# EAGLE design HandschuhGyro (EAGLE 6.5.0)
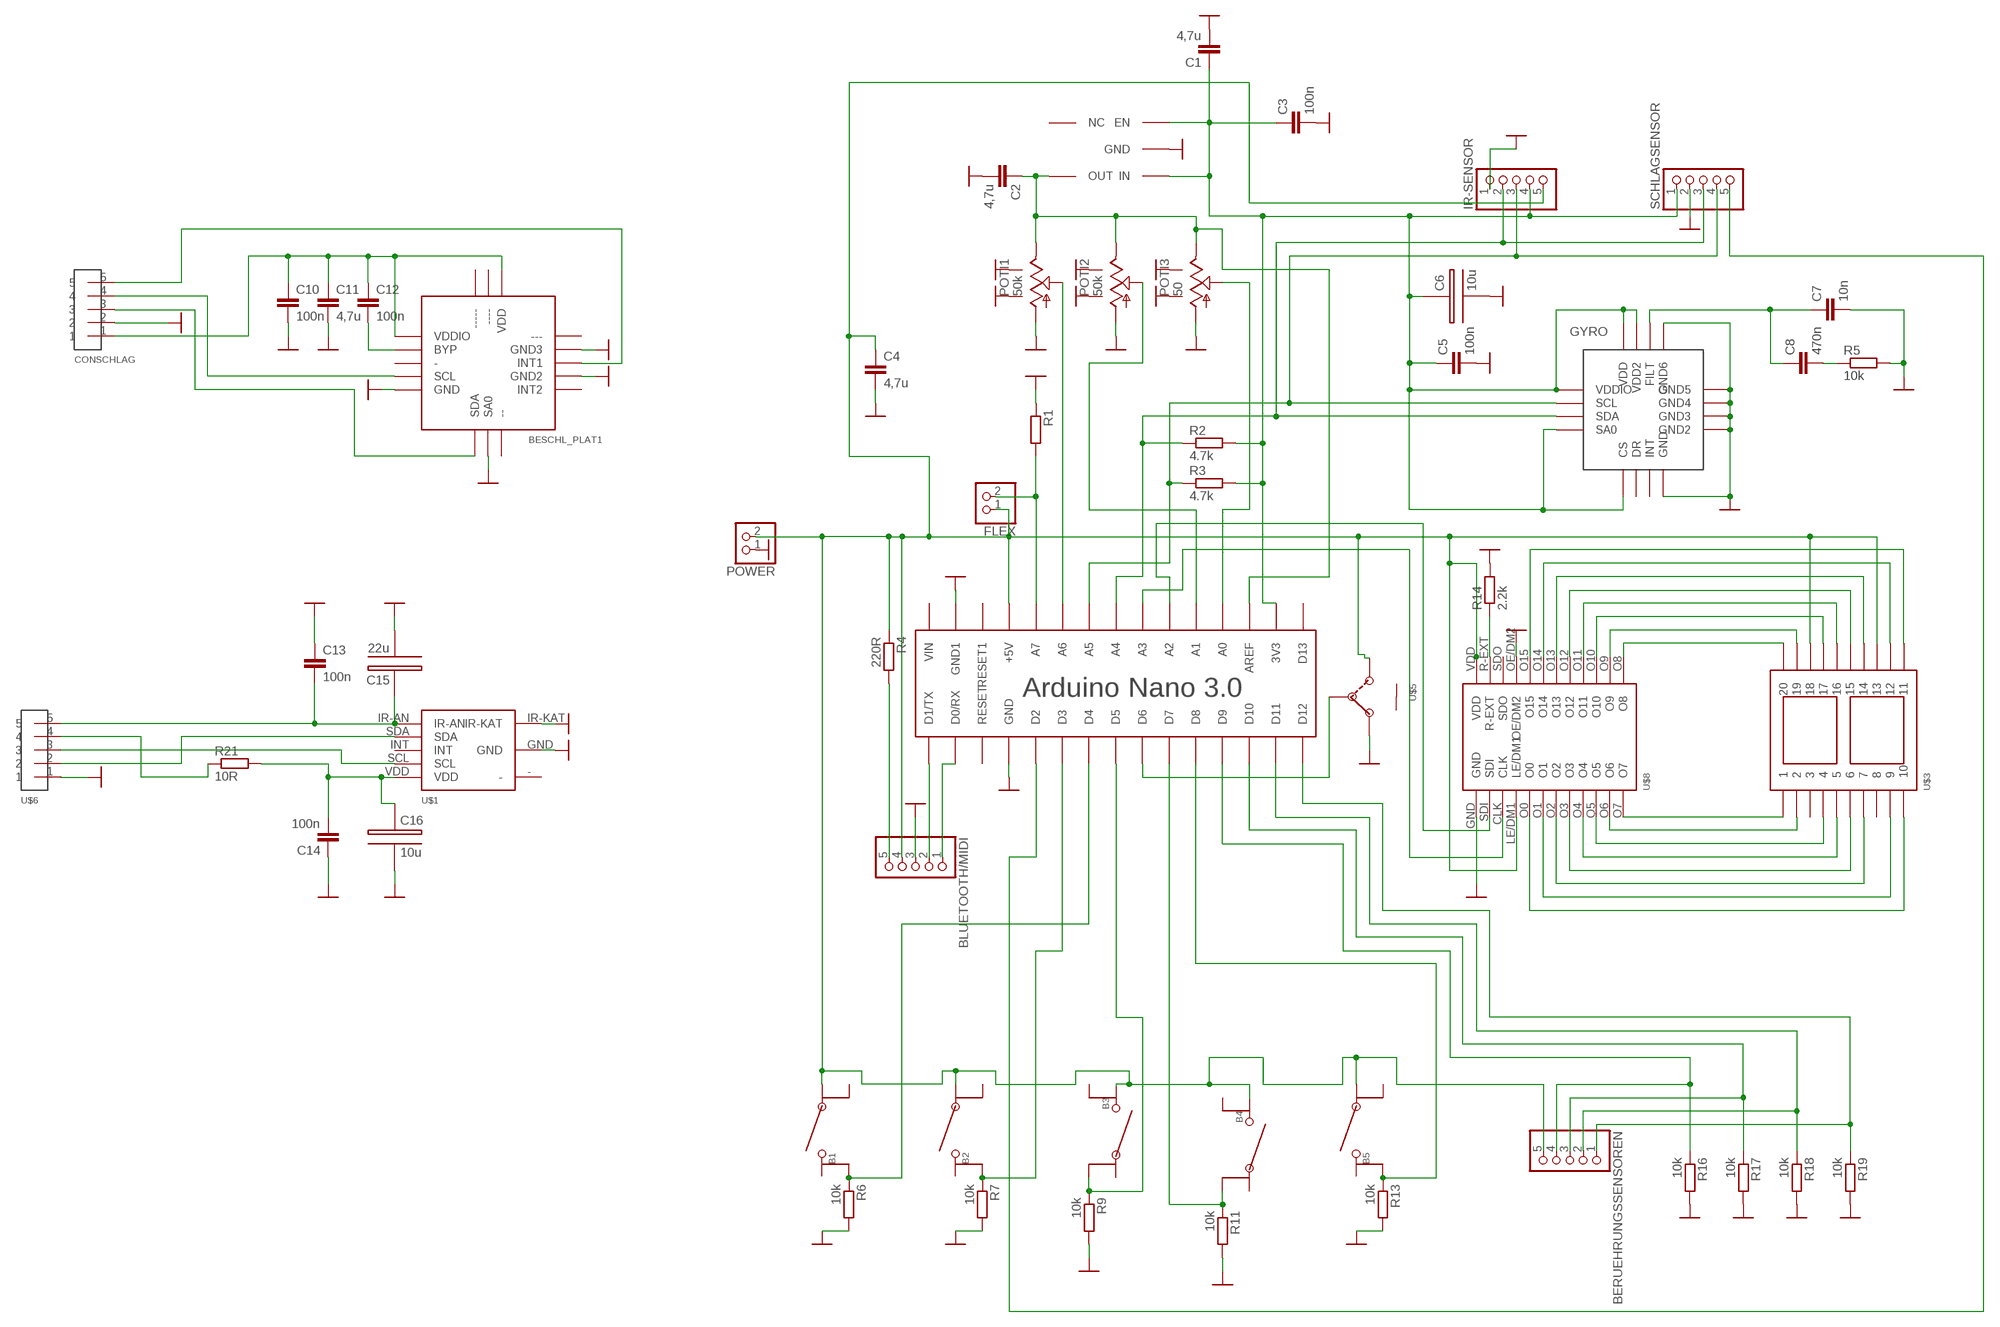
[diagram p0: schematic, sheet 1]

## Parts
B1  BUTTON  [BUTTON]
B2  BUTTON  [BUTTON]
B3  BUTTON  [BUTTON]
B4  BUTTON  [BUTTON]
B5  BUTTON  [BUTTON]
BERUEHRUNGSSENSOREN  PINHD-1X5  [1X05]
BESCHL_PLAT1  BESCHLEUNIGSUNGSSENSOR  [BESCHLEUNIGUNGSSENSOR]
BLUETOOTH/MIDI  PINHD-1X5  [1X05]
C1  4,7u  C-EUC0805  [C0805]
C2  4,7u  C-EUC0805  [C0805]
C3  100n  C-EUC0805  [C0805]
C4  4,7u  C-EUC0805  [C0805]
C5  100n  C-EUC0805  [C0805]
C6  10u  22U-KONDENSATOR  [22U-KONDENSATOR]
C7  10n  C-EUC0805  [C0805]
C8  470n  C-EUC0805  [C0805]
C10  100n  C-EUC0805  [C0805]
C11  4,7u  C-EUC0805  [C0805]
C12  100n  C-EUC0805  [C0805]
C13  100n  C-EUC0805  [C0805]
C14  100n  C-EUC0805  [C0805]
C15  22u  22U-KONDENSATOR  [22U-KONDENSATOR]
C16  10u  22U-KONDENSATOR  [22U-KONDENSATOR]
CONSCHLAG  BREAKBOARDCON2  [BREAKBOARDCON]
FLEX  PINHD-1X2  [1X02]
GYRO  GYRO  [GYRO]
IR-SENSOR  PINHD-1X5  [1X05]
POTI1  50k  POTI  [POTI]
POTI2  50k  POTI  [POTI]
POTI3  50  POTI  [POTI]
POWER  PINHD-1X2  [1X02]
R1  R-EU_M0805  [M0805]
R2  4.7k  R-EU_M0805  [M0805]
R3  4.7k  R-EU_M0805  [M0805]
R4  220R  R-EU_M0805  [M0805]
R5  10k  R-EU_M0805  [M0805]
R6  10k  R-EU_M0805  [M0805]
R7  10k  R-EU_M0805  [M0805]
R9  10k  R-EU_M0805  [M0805]
R11  10k  R-EU_M0805  [M0805]
R13  10k  R-EU_M0805  [M0805]
R14  2.2k  R-EU_M0805  [M0805]
R16  10k  R-EU_M0805  [M0805]
R17  10k  R-EU_M0805  [M0805]
R18  10k  R-EU_M0805  [M0805]
R19  10k  R-EU_M0805  [M0805]
R21  10R  R-EU_M0805  [M0805]
SCHLAGSENSOR  PINHD-1X5  [1X05]
U$1  IR-SENSOR  [IR-SENSOR]
U$2  ARDUINONANO  [PDIP-32]
U$3  7-SEGMENT  [7-SEGMENT]
U$4  1,1V-SPANNUNGSREGLER  [1,1V-SPANNUNGSREGLER]
U$5  SCHALTER  [SCHALTER]
U$6  BREAKBOARDCON2  [BREAKBOARDCON]
U$8  7-SEGMENT-TREIBER  [7-SEGMENT-TREIBER]

## Nets
3,3V: C1.1 C3.1 C5.1 C6.+ GYRO.CS GYRO.SA0 GYRO.VDD GYRO.VDD2 GYRO.VDDIO IR-SENSOR.4 R2.2 R3.2 SCHLAGSENSOR.1 U$2.3V3 U$4.EN U$4.IN
3,3V1: BESCHL_PLAT1.VDD BESCHL_PLAT1.VDDIO C10.1 C11.1 C12.1 CONSCHLAG.1
5V: B1.3 B2.3 B3.1 B4.1 B5.3 BERUEHRUNGSSENSOREN.5 BLUETOOTH/MIDI.4 C4.1 FLEX.1 IR-SENSOR.5 POWER.2 R4.1 U$2.+5V U$3.13 U$3.18 U$5.3 U$8.LE/DM1 U$8.VDD
GND: BESCHL_PLAT1.GND BESCHL_PLAT1.GND2 BESCHL_PLAT1.GND3 BESCHL_PLAT1.SA0 BLUETOOTH/MIDI.3 C1.2 C2.2 C3.2 C4.2 C5.2 C6.- C7.2 C10.2 C11.2 C13.1 C14.1 C15.- C16.- CONSCHLAG.2 GYRO.GND GYRO.GND2 GYRO.GND3 GYRO.GND4 GYRO.GND5 GYRO.GND6 IR-SENSOR.1 POTI1.FIX1(FUSS1) POTI1.FIX2(FUSS2) POTI1.GND POTI2.FIX1(FUSS1) POTI2.FIX2(FUSS2) POTI2.GND POTI3.FIX1(FUSS1) POTI3.FIX2(FUSS2) POTI3.GND POWER.1 R1.1 R5.2 R6.2 R7.2 R9.2 R11.2 R13.2 R14.2 R16.2 R17.2 R18.2 R19.2 SCHLAGSENSOR.2 U$1.GND U$1.IR-KAT U$2.GND U$2.GND1 U$4.GND U$5.1 U$6.1 U$8.GND U$8.OE/DM2
N$1: C2.1 POTI1.VCC POTI2.VCC POTI3.VCC U$2.AREF U$4.OUT
N$2: BESCHL_PLAT1.BYP C12.2
N$3: C7.1 C8.1 GYRO.FILT
N$4: FLEX.2 R1.2 U$2.A0(A7)
N$5: C8.2 R5.1
N$6: SCHLAGSENSOR.5 U$2.D2
N$7: POTI1.VALUE U$2.A1(A6)
N$8: POTI2.VALUE U$2.A6(A1)
N$9: U$1.SDA U$6.2
N$10: BESCHL_PLAT1.SCL CONSCHLAG.4
N$11: BLUETOOTH/MIDI.2 U$2.D1/TX
N$12: BLUETOOTH/MIDI.1 U$2.D0/RX
N$13: BLUETOOTH/MIDI.5 R4.2
N$14: BESCHL_PLAT1.SDA CONSCHLAG.3
N$15: B1.2 R6.1 U$2.D4
N$16: R21.1 U$6.4
N$17: B2.2 R7.1 U$2.D3
N$20: B4.4 R11.1 U$2.D7
N$21: B5.2 R13.1 U$2.D8
N$28: U$2.A5(A2) U$8.SDI
N$30: U$2.A4(A3) U$8.CLK
N$31: U$3.9 U$8.O1
N$32: U$3.1 U$8.O7
N$33: U$3.2 U$8.O6
N$34: U$3.4 U$8.O5
N$35: U$3.5 U$8.O4
N$36: U$3.6 U$8.O3
N$37: U$3.7 U$8.O2
N$38: U$3.10 U$8.O0
N$39: U$3.20 U$8.O8
N$40: U$3.19 U$8.O9
N$41: U$3.17 U$8.O10
N$42: U$3.16 U$8.O11
N$43: U$3.15 U$8.O12
N$44: U$3.14 U$8.O13
N$45: U$3.12 U$8.O14
N$46: U$3.11 U$8.O15
N$47: BERUEHRUNGSSENSOREN.4 R16.1 U$2.D9
N$48: R14.1 U$8.R-EXT
N$50: BESCHL_PLAT1.INT1 CONSCHLAG.5
N$51: BERUEHRUNGSSENSOREN.3 R17.1 U$2.D10
N$52: BERUEHRUNGSSENSOREN.2 R18.1 U$2.D11
N$53: BERUEHRUNGSSENSOREN.1 R19.1 U$2.D12
N$54: U$2.D6 U$5.2
N$55: GYRO.SCL IR-SENSOR.3 R3.1 SCHLAGSENSOR.4 U$2.A2(A5)
N$56: C13.2 C15.+ U$1.IR-AN U$6.5
N$57: C14.2 C16.+ R21.2 U$1.VDD
N$58: GYRO.SDA IR-SENSOR.2 R2.1 SCHLAGSENSOR.3 U$2.A3(A4)
N$61: U$1.SCL U$6.3
N$67: POTI3.VALUE U$2.A7(A0)
N$69: B3.4 R9.1 U$2.D5
Unconnected: B1.1 B1.4 B2.1 B2.4 B3.2 B3.3 B4.2 B4.3 B5.1 B5.4 BESCHL_PLAT1.- BESCHL_PLAT1.-- BESCHL_PLAT1.--- BESCHL_PLAT1.---- BESCHL_PLAT1.----- BESCHL_PLAT1.INT2 GYRO.DR GYRO.INT U$1.- U$1.INT U$2.D13 U$2.RESET U$2.RESET1 U$2.VIN U$3.3 U$3.8 U$4.NC U$5.4 U$5.5 U$8.SDO

## Notes on the sheet
- Arduino Nano 3.0

## Library data of the parts
B1-B5 = Handschuh:BUTTON
BERUEHRUNGSSENSOREN BLUETOOTH/MIDI IR-SENSOR SCHLAGSENSOR = pinhead:PINHD-1X5: PIN HEADER
BESCHL_PLAT1 = beschleunigungssensor:BESCHLEUNIGSUNGSSENSOR
C1-C5 C7 C8 C10-C14 = rcl:C-EU: CAPACITOR, European symbol
C6 C15 C16 = Handschuh:22U-KONDENSATOR
CONSCHLAG U$6 = BreakboardCon:BREAKBOARDCON2
FLEX POWER = pinhead:PINHD-1X2: PIN HEADER
GYRO = Handschuh:GYRO
POTI1-POTI3 = Poti:POTI
R1-R7 R9 R11 R13 R14 R16-R19 R21 = rcl:R-EU_: RESISTOR, European symbol
U$1 = Handschuh:IR-SENSOR
U$2 = jet-lib:ARDUINONANO
U$3 = Handschuh:7-SEGMENT
U$4 = Handschuh:1,1V-SPANNUNGSREGLER
U$5 = Handschuh:SCHALTER
U$8 = Handschuh:7-SEGMENT-TREIBER

## Board
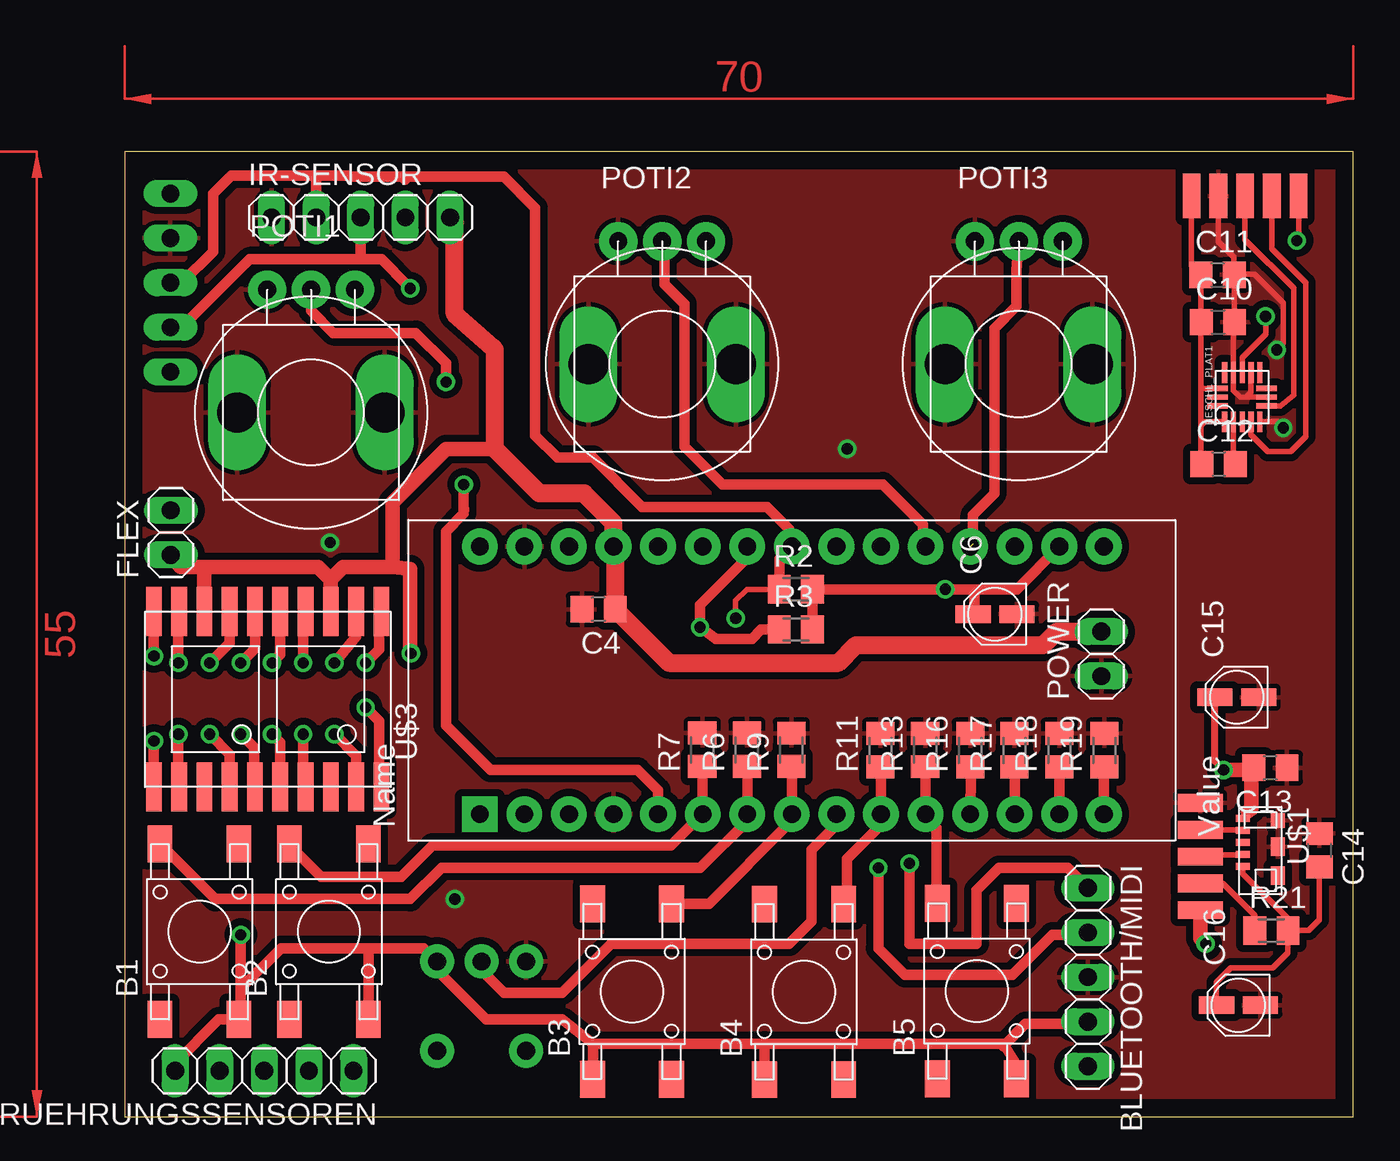
[diagram p1: board, top side]
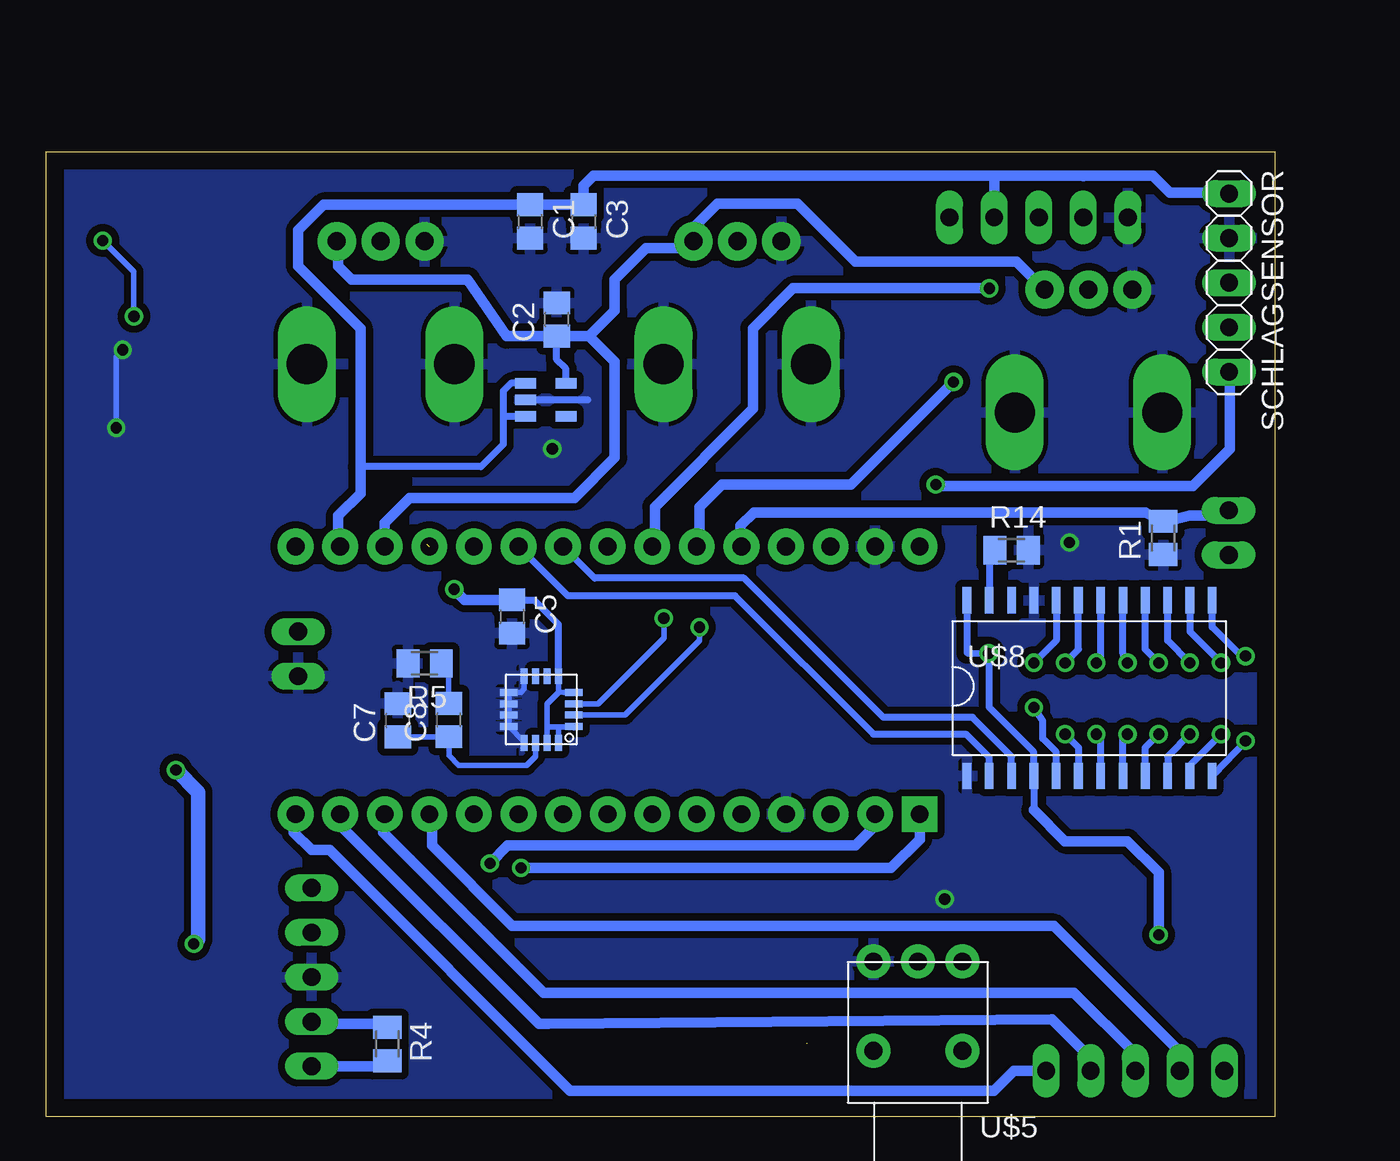
[diagram p2: board, bottom side, seen from below]

Size 70 x 55 mm. Coordinates in mm from the lower left corner, seen from the top.
Outline: 0,0 70,0 70,55 0,55 0,0
Copper layers (1*16): Top 0.035mm / dielectric 1.5mm / Bottom 0.035mm
Design rules "default *": minimum track width 10mil, minimum drill 24mil, track to track 8mil, track to pad 8mil, pad to pad 8mil, via to via 8mil, smd to smd 8mil, copper to edge 40mil, drill to drill 8mil, minimum pad ring 10mil, minimum via ring 8mil, stop-mask expansion 4mil, vias tented up to drill 0mil, thermal gap 10mil

### Footprints (pad centres in the part's own frame; a part is rotated, then mirrored left to right if it is on the bottom)
BUTTON = smd 2.1 x 1.4: 1 0,0; 2 10,0; 3 0,-4.5; 4 10,-4.5
1X05 = drill 1.016 long: 1 -5.08,0; 2 -2.54,0; 3 0,0; 4 2.54,0; 5 5.08,0
BESCHLEUNIGUNGSSENSOR = smd 1.17 x 0.3: - 0.1,-1.5; --- 2.9,-0.5; BYP 0.1,-1; GND 0.1,-2.5; GND2 2.9,-2; GND3 2.9,-1; INT1 2.9,-1.5; INT2 2.9,-2.5; SCL 0.1,-2; VDDIO 0.1,-0.5 | smd 0.3 x 1.17: -- 2,-2.9; ---- 1.5,-0.1; ----- 1,-0.1; SA0 1.5,-2.9; SDA 1,-2.9; VDD 2,-0.1
C0805 = smd 1.3 x 1.5: 1 -0.95,0; 2 0.95,0
22U-KONDENSATOR = smd 1 x 2: + 0,-0.5; - 0,-3
BREAKBOARDCON = smd 1.016 x 2.54: 1 -4.318,0; 2 -2.794,0; 3 -1.27,0; 4 0.254,0; 5 1.778,0
1X02 = drill 1.016 long: 1 -1.27,0; 2 1.27,0
GYRO = smd 0.4 x 0.9: CS -0.975,-3.9; DR -0.325,-3.9; FILT 0.325,-0.1; GND 0.975,-3.9; GND6 0.975,-0.1; INT 0.325,-3.9; VDD -0.975,-0.1; VDD2 -0.325,-0.1 | smd 1 x 0.4: GND2 1.85,-2.975; GND3 1.85,-2.325; GND4 1.85,-1.675; GND5 1.85,-1.025; SA0 -1.85,-2.975; SCL -1.85,-1.675; SDA -1.85,-2.325; VDDIO -1.85,-1.025
POTI = drill 2.286 pad 2.54 long: FIX1 -4.2,0; FIX2 4.2,0 | drill 1.016 pad 2.184: GND -2.5,7; VALUE 0,7; VCC 2.5,7
M0805 = smd 1.3 x 1.6: 1 -0.95,0; 2 0.95,0
IR-SENSOR = smd 1.05 x 0.8: - 3.925,-0.2; GND 2.275,-0.2 | smd 0.4 x 0.8: INT 2.02,-2.2; IR-AN 0.65,-2.2; SCL 2.705,-2.2; SDA 1.335,-2.2; VDD 3.39,-2.2 | smd 0.83 x 0.8: IR-KAT 0.785,-0.2
PDIP-32 = drill 1.016 pad 2.032: 3V3 15.24,-35.56; +5V 15.24,-10.16; A0 15.24,-12.7; A1 15.24,-15.24; A2 15.24,-17.78; A3 15.24,-20.32; A4 15.24,-22.86; A5 15.24,-25.4; A6 15.24,-27.94; A7 15.24,-30.48; AREF 15.24,-33.02; D0/RX 0,-5.08; D2 0,-12.7; D3 0,-15.24; D4 0,-17.78; D5 0,-20.32; D6 0,-22.86; D7 0,-25.4; D8 0,-27.94; D9 0,-30.48; D10 0,-33.02; D11 0,-35.56; D12 0,-38.1; D13 15.24,-38.1; GND 0,-10.16; GND1 15.24,-5.08; RESET 0,-7.62; RESET1 15.24,-7.62; VIN 15.24,-2.54 | drill 1.016 pad 2.032 square: D1/TX 0,-2.54
7-SEGMENT = smd 0.9 x 2.8: 1 0,-10; 2 1.44,-10; 3 2.88,-10; 4 4.32,-10; 5 5.76,-10; 6 7.2,-10; 7 8.64,-10; 8 10.08,-10; 9 11.52,-10; 10 12.96,-10; 11 12.96,0; 12 11.52,0; 13 10.08,0; 14 8.64,0; 15 7.2,0; 16 5.76,0; 17 4.32,0; 18 2.88,0; 19 1.44,0; 20 0,0
1,1V-SPANNUNGSREGLER = smd 0.6 x 1.2: EN -0.95,0; GND 0,0; IN 0.95,0; NC -0.95,-2.3; OUT 0.95,-2.3
SCHALTER = drill 1.016 pad 1.93: 1 -2.54,2.54; 2 0,2.54; 3 2.54,2.54; 4 -2.54,-2.54; 5 2.54,-2.54
7-SEGMENT-TREIBER = smd 0.5 x 1.5: CLK -11.43,-10; GND -13.97,-10; LE/DM1 -10.16,-10; O0 -8.89,-10; O1 -7.62,-10; O2 -6.35,-10; O3 -5.08,-10; O4 -3.81,-10; O5 -2.54,-10; O6 -1.27,-10; O7 0,-10; O8 0,0; O9 -1.27,0; O10 -2.54,0; O11 -3.81,0; O12 -5.08,0; O13 -6.35,0; O14 -7.62,0; O15 -8.89,0; OE/DM2 -10.16,0; R-EXT -12.7,0; SDI -12.7,-10; SDO -11.43,0; VDD -13.97,0

### Placement (x,y rotation side)
B1  2.02,5.55 90 top
B2  9.39,5.55 90 top
B3  26.66,2.14 90 top
B4  36.45,2.12 90 top
B5  46.3,2.16 90 top
BERUEHRUNGSSENSOREN  7.95,2.62 180 top
BESCHL_PLAT1  62.17,39.5 90 top
BLUETOOTH/MIDI  54.88,7.96 270 top
C1  42.43,51.01 270 bottom
C2  40.91,45.42 90 bottom
C3  39.39,51.01 270 bottom
C4  27,28.91 180 top
C5  43.46,28.51 270 bottom
C6  47.84,28.64 90 top
C7  49.97,22.59 90 bottom
C8  47.06,22.6 90 bottom
C10  62.28,45.28 0 top
C11  62.26,47.97 0 top
C12  62.32,37.19 0 top
C13  65.27,19.88 180 top
C14  68.06,15.18 270 top
C15  61.61,23.91 90 top
C16  61.71,6.36 90 top
CONSCHLAG  65.1,52.46 0 top
FLEX  2.63,33.28 90 top
GYRO  41.79,21.21 180 bottom
IR-SENSOR  13.45,51.24 0 top
POTI1  10.62,40.13 0 top
POTI2  30.62,42.88 0 top
POTI3  50.94,42.88 0 top
POWER  55.64,26.37 90 top
R1  6.37,32.98 90 bottom
R2  38.24,30.06 0 top
R3  38.24,27.77 0 top
R4  50.56,4.15 270 bottom
R5  48.44,25.84 180 bottom
R6  35.45,20.91 90 top
R7  32.91,20.91 90 top
R9  37.98,20.91 90 top
R11  43.06,20.89 90 top
R13  45.61,20.9 90 top
R14  15,32.28 0 bottom
R16  48.17,20.89 90 top
R17  50.69,20.89 90 top
R18  53.25,20.89 90 top
R19  55.82,20.89 90 top
R21  65.33,10.61 0 top
SCHLAGSENSOR  2.61,47.52 270 bottom
U$1  65.91,17.66 270 top
U$2  17.69,17.25 90 top
U$3  1.67,28.79 0 top
U$4  42.69,40.85 90 bottom
U$5  20.34,6.31 0 bottom
U$6  61.28,13.56 270 top
U$8  3.57,29.42 0 bottom

### Tracks (layer width: path | path; a pad name or v marks a point on that pad's centre or on a via)
3,3V  (via drill 0.64 pad 1.02)
  Top 0.61: U$2.3V3 50.82,30.06 48.4,30.06 | R3.2 R2.2 v46.75,30.06 48.4,30.06 | C6.+ 48.4,28.64 48.4,30.06
  Bottom 0.305: 40.82,22.21 GYRO.VDD | GYRO.VDD2 41.47,22.21 | 41.47,22.21 40.82,22.21 | 40.82,22.21 39.94,22.21 | GYRO.CS 40.82,24.2 | 41.47,22.21 41.47,23.53 40.82,24.18 40.82,24.2 | 40.82,24.2 40.5,24.19 GYRO.SA0
  Bottom 0.406: U$4.IN 43.52,41.8 43.96,41.36 43.96,39.84 | 43.96,39.84 43.96,38.31 45.23,37.04 52.09,37.04 | U$4.EN 43.89,39.9 43.96,39.84 | GYRO.CS 40.82,28.06 42.18,29.42 43.42,29.42 C5.1 | GYRO.VDD2 | 39.94,22.21 GYRO.VDDIO
  Bottom 0.61: 10.94,53.63 6.95,53.63 5.99,52.66 2.54,52.66 SCHLAGSENSOR.1 2.73,52.6 | 10.94,53.63 16.02,53.63 | 16.02,53.63 38.8,53.63 39.39,53.04 C3.1 C1.1 54.18,51.96 55.64,50.5 55.64,48.47 52.09,44.92 52.09,37.04 52.09,35.52 53.36,34.25 53.36,32.59 U$2.3V3 | C5.1 46.15,29.46 v46.75,30.06 | 10.91,53.6 10.94,53.63 | IR-SENSOR.4 15.99,53.6 16.02,53.63
3,3V1
  Top 0.305: CONSCHLAG.1 60.78,48.5 C11.1 61.31,45.3 | 61.31,45.3 C10.1 | 61.31,45.3 61.31,41.62 | 61.31,41.62 61.31,39.38 | 61.31,39.38 61.31,37.25 C12.1 | BESCHL_PLAT1.VDD 61.43,41.5 61.31,41.62 | BESCHL_PLAT1.VDDIO 61.53,39.6 61.31,39.38
5V  (via drill 0.64 pad 1.02)  (1 unrouted)
  Top 0.61: 15.26,31.33 15.32,31.33 | 4.52,28.81 U$3.18 | v16.3,26.41 16.27,26.44 | 13.99,9.61 17.03,9.61 U$5.3 17.8,8.34 20.59,5.55 24.91,5.55 26.66,4.18 | 13.99,9.61 8.91,9.61 6.62,7.32 | 6.62,7.32 6.62,5.64 B1.3 5.35,5.55 2.81,3.01 2.81,2.69 BERUEHRUNGSSENSOREN.5 | B2.3 13.89,9.51 13.99,9.61 | 36.59,4.15 26.69,4.15 26.69,2.05 B3.1 | 36.59,4.15 50.05,4.15 | 50.05,4.15 50.82,3.01 50.82,2.05 B5.3 | v6.62,10.37 6.62,7.32 | 50.05,4.15 50.05,4.02 51.32,5.29 54.75,5.29 BLUETOOTH/MIDI.4 | B4.1 36.45,4.16 36.59,4.15
  Top 0.813: U$3.13 11.75,30.61 | 11.75,30.61 12.46,31.33 15.26,31.33 15.26,35.01 18.3,38.06 21.1,38.06 | 15.32,31.33 16.27,31.2 16.27,26.44 | 4.52,31.33 11.03,31.33 11.75,30.61 | 4.52,31.33 4.52,28.81 | 4.52,31.33 3.19,31.33 FLEX.1
  Top 1.016: POWER.2 53.1,27.64 52.34,26.88 41.67,26.88 40.66,25.87 31,25.87 C4.1 27.95,32.39 U$2.+5V 27.85,33.84 26.18,35.52 23.64,35.52 21.1,38.06 21.1,43.71 20.97,43.84 18.81,45.74 18.81,50.96 IR-SENSOR.5
  Bottom 0.406: U$8.VDD 17.54,26.44 v16.3,26.41 16.27,26.37 16.27,23.33 13.73,20.79 U$8.LE/DM1 13.73,17.48
  Bottom 0.61: 13.73,17.48 11.95,15.71 8.4,15.71 6.62,13.93 v6.62,10.37 | R4.1 50.88,5.1 51.07,5.29 54.75,5.29 BLUETOOTH/MIDI.4
GND  (via drill 0.64 pad 1.02)
  Top 0.305: C11.2 63.21,45.3 C10.2 63.23,44.96 63.17,44.89 BESCHL_PLAT1.GND3 | 63.17,42.11 BESCHL_PLAT1.GND3 | BESCHL_PLAT1.GND3 63.17,41.39 63.55,41.01 63.91,41.01 | 63.91,41.01 BESCHL_PLAT1.SA0 65.09,40.98 | BESCHL_PLAT1.GND2 64.17,41.27 63.91,41.01 | CONSCHLAG.2 62.31,49.87 63.2,48.98 63.2,47.99 C11.2 | BESCHL_PLAT1.GND 65.67,39.6 v66.02,39.25 | C11.2 63.26,48.02 64.36,48.02 66.02,46.37 66.02,44.08 v65.63,43.7
  Bottom 0.305: GYRO.GND 42.77,24.36 42.94,24.19 GYRO.GND2 | GYRO.GND2 | GYRO.GND2 GYRO.GND3 GYRO.GND4 GYRO.GND5 42.77,21.36 GYRO.GND6 | v66.02,39.25 66.02,43.32 v65.63,43.7
  Bottom 0.406: U$8.GND 17.54,19.82 | U$4.GND 39.13,40.85
  other vias: 11.7,32.72 41.16,38.06 18.81,12.4
  pour Top (isolate 0.406): 0,55 70,55 70,0 0,0
  pour Bottom (isolate 0.406): 0,55 70,55 70,0 0,0
N$1
  Bottom 0.406: U$4.OUT 40.39,42.62 40.91,43.14 C2.1
  Bottom 0.61: POTI3.VCC 53.36,49.29 53.36,48.47 52.59,47.71 45.99,47.71 43.77,44.47 C2.1 39.07,44.47 | POTI1.VCC 14.72,48.73 23.89,48.73 27.19,52.03 31.77,52.03 33.12,50.67 POTI2.VCC 33.52,49.49 35.83,49.49 37.61,47.71 37.61,45.93 39.07,44.47 | U$2.AREF 50.71,33.84 49.29,35.26 39.89,35.26 37.61,37.55 37.61,43.02 39.07,44.47
N$2
  Top 0.305: 63.17,37.55 C12.2 63.17,37.29 BESCHL_PLAT1.BYP
N$3
  Bottom 0.305: GYRO.FILT 42.12,20.54 42.64,20.02 46.5,20.02 47.06,20.58 C8.1 49.95,21.65 C7.1
N$4
  Bottom 0.61: U$2.A0 30.39,33.14 30.43,33.19 30.43,33.68 29.67,34.44 7.38,34.44 R1.2 6.18,33.93 4.84,34.25 2.81,34.25 FLEX.2
N$5
  Bottom 0.305: C8.2 47.06,25.87 R5.1
N$6  (via drill 0.64 pad 1.02)
  Top 0.61: U$2.D2 30.39,18.6 29.23,19.77 20.84,19.77 18.3,22.31 18.3,33.36 19.32,34.38 19.33,34.63 19.32,34.64 v19.32,36.03
  Bottom 0.61: SCHLAGSENSOR.5 2.56,42.37 2.56,38.06 4.66,35.95 19.24,35.95 v19.32,36.03
N$7  (via drill 0.64 pad 1.02)
  Top 0.61: POTI1.VALUE 10.62,45.93 11.89,44.66 16.59,44.66 18.3,42.95 v18.3,41.87
  Bottom 0.61: v18.3,41.87 24.15,36.03 31.51,36.03 32.78,34.76 32.78,32.64 U$2.A1
N$8
  Top 0.61: U$2.A6 45.48,32.64 45.48,33.74 43.2,36.03 34.05,36.03 31.89,38.19 31.89,46.31 30.75,47.46 30.75,49.25 POTI2.VALUE
N$9
  Top 0.305: U$6.2 63.68,16.35 U$1.SDA
N$10
  Top 0.305: BESCHL_PLAT1.SCL 64.17,38.87 65.13,37.91 66.45,37.91 67.28,38.75 67.28,47.53 65.36,49.47 CONSCHLAG.4
N$11  (via drill 0.64 pad 1.02)
  Top 0.61: v42.94,14.18 42.94,9.61 44.47,8.09 50.56,8.09 52.85,10.37 54.75,10.37 BLUETOOTH/MIDI.2
  Bottom 0.61: U$2.D1/TX 20.23,15.81 21.86,14.18 v42.94,14.18
N$12  (via drill 0.64 pad 1.02)
  Top 0.61: v44.72,14.44 44.72,9.86 48.53,9.86 48.53,12.91 49.8,14.18 53.74,14.18 BLUETOOTH/MIDI.1
  Bottom 0.61: U$2.D0/RX 22.77,16.57 23.89,15.45 43.7,15.45 v44.72,14.44
N$13
  Bottom 0.61: BLUETOOTH/MIDI.5 50.88,2.88 R4.2
N$14
  Top 0.305: CONSCHLAG.3 63.83,49.97 66.6,47.2 66.6,41.14 65.84,40.5 BESCHL_PLAT1.SDA
N$15
  Top 0.61: B1.2 5.17,12.4 16.27,12.4 18.05,14.18 32.78,14.18 35.47,16.87 U$2.D4 35.47,19.96 R6.1
  Bottom 0.61: 35.45,17.27 U$2.D4
N$16
  Top 0.305: U$6.4 62.55,13.3 64.38,11.48 R21.1
N$17
  Top 0.61: B2.2 9.39,15.48 11.19,13.67 15.76,13.67 17.54,15.45 31.14,15.45 U$2.D3 32.91,17.25 R7.1 32.93,19.94
N$20
  Top 0.61: B4.4 41.16,12.04 41.16,14.69 43.09,16.62 U$2.D7 43.09,19.91 R11.1
N$21
  Top 0.61: B5.2 46.24,12.1 46.24,16.47 45.63,17.08 U$2.D8 45.63,19.92 R13.1
N$28
  Bottom 0.406: U$8.SDI 16.27,20.47 17.61,21.8 22.88,21.8 30.75,29.68 40.28,29.68 U$2.A5
N$30
  Bottom 0.406: U$8.CLK 15,20.53 17.22,22.75 22.3,22.75 30.24,30.69 38.76,30.69 U$2.A4
N$31  (via drill 0.64 pad 1.02)
  Top 0.61: U$3.9 13.19,20.57 v11.95,21.8
  Bottom 0.406: v11.95,21.8 11.19,21.04 U$8.O1
N$32  (via drill 0.64 pad 1.02)
  Top 0.61: U$3.1 v1.67,21.42
  Bottom 0.406: v1.67,21.42 3.48,19.52 U$8.O7
N$33  (via drill 0.64 pad 1.02)
  Top 0.61: v3.06,21.8 3.06,18.83 U$3.2
  Bottom 0.406: 4.84,19.9 U$8.O6 4.84,20.02 v3.06,21.8
N$34  (via drill 0.64 pad 1.02)
  Top 0.61: U$3.4 5.99,20.66 v4.84,21.8
  Bottom 0.406: v4.84,21.8 6.11,20.53 U$8.O5
N$35  (via drill 0.64 pad 1.02)
  Top 0.61: v6.62,21.8 7.38,21.04 7.38,19.34 U$3.5
  Bottom 0.406: U$8.O4 7.38,21.04 v6.62,21.8
N$36  (via drill 0.64 pad 1.02)
  Top 0.61: U$3.6 8.87,21.33 v8.4,21.8
  Bottom 0.406: U$8.O3 8.65,21.55 v8.4,21.8
N$37  (via drill 0.64 pad 1.02)
  Top 0.61: v10.18,21.8 10.18,19.43 U$3.7
  Bottom 0.406: U$8.O2 9.92,21.55 v10.18,21.8
N$38  (via drill 0.64 pad 1.02)
  Top 0.61: v13.73,23.33 14.49,22.56 14.49,19.43 U$3.10
  Bottom 0.406: U$8.O0 12.46,20.79 13.22,21.55 13.22,22.56 v13.73,23.33
N$39  (via drill 0.64 pad 1.02)
  Top 0.61: U$3.20 v1.67,26.25
  Bottom 0.406: v1.67,26.25 1.92,26.25 3.57,27.9 U$8.O8
N$40  (via drill 0.64 pad 1.02)
  Top 0.61: v3.06,25.87 3.06,28.74 U$3.19
  Bottom 0.406: U$8.O9 4.84,27.64 v3.06,25.87
N$41  (via drill 0.64 pad 1.02)
  Top 0.61: U$3.17 5.99,27.01 v4.84,25.87
  Bottom 0.406: v4.84,25.87 6.11,27.14 U$8.O10
N$42  (via drill 0.64 pad 1.02)
  Top 0.61: U$3.16 7.43,26.67 v6.62,25.87
  Bottom 0.406: v6.62,25.87 7.38,26.63 U$8.O11
N$43  (via drill 0.64 pad 1.02)
  Top 0.61: U$3.15 8.87,26.33 v8.4,25.87
  Bottom 0.406: v8.4,25.87 8.65,26.37 U$8.O12
N$44  (via drill 0.64 pad 1.02)
  Top 0.61: v10.18,25.87 10.18,29.16 U$3.14
  Bottom 0.406: v10.18,25.87 9.92,26.12 U$8.O13
N$45  (via drill 0.64 pad 1.02)
  Top 0.61: U$3.12 13.19,27.35 v11.95,25.87
  Bottom 0.406: v11.95,25.87 11.19,26.63 U$8.O14
N$46  (via drill 0.64 pad 1.02)
  Top 0.61: v13.73,25.87 14.49,26.63 14.49,29.16 U$3.11
  Bottom 0.406: U$8.O15 12.46,27.14 v13.73,25.87
N$47
  Top 0.61: R16.1 48.22,19.61 U$2.D9
  Bottom 0.61: BERUEHRUNGSSENSOREN.4 5.41,3.7 12.59,10.88 43.45,10.88 48.02,15.45 48.02,17.1 U$2.D9
N$48
  Bottom 0.406: 16.27,32.15 U$8.R-EXT
  Bottom 0.61: R14.1 16.21,32.03 16.27,32.15
N$50  (via drill 0.64 pad 1.02)
  Top 0.305: BESCHL_PLAT1.INT1 63.67,43.26 65,44.59 v65,45.61 | v66.78,49.92 66.9,50.05 66.9,52.44 CONSCHLAG.5
  Bottom 0.305: v65,45.61 65,48.14 v66.78,49.92
N$51
  Top 0.61: R17.1 50.71,19.92 U$2.D10
  Bottom 0.61: BERUEHRUNGSSENSOREN.3 7.95,3.58 11.45,7.07 41.67,7.07 50.82,16.21 50.82,17.14 U$2.D10
N$52
  Top 0.61: R18.1 U$2.D11
  Bottom 0.61: BERUEHRUNGSSENSOREN.2 10.49,3.32 12.72,5.55 41.42,5.29 41.93,5.29 53.1,16.47 53.1,17.1 U$2.D11
N$53
  Top 0.61: 55.79,19.61 R19.1 55.79,19.91 U$2.D12
  Bottom 0.61: BERUEHRUNGSSENSOREN.1 14.88,2.62 16.02,1.48 40.15,1.48 53.86,15.2 54.88,15.2 55.9,16.21 55.9,17.14 U$2.D12
N$54
  Top 0.61: U$2.D6 40.55,16.62 39.13,15.2 39.13,11.13 37.86,9.86 27.7,9.86 24.91,7.07 21.61,7.07 20.34,8.34 U$5.2
N$55  (via drill 0.64 pad 1.02)
  Top 0.61: SCHLAGSENSOR.4 3.19,44.93 7.13,48.87 13.48,48.87 | 13.48,48.87 14.63,48.87 16.16,47.32 v16.27,47.2 | R3.1 36.26,27.77 35.73,27.24 33.7,27.24 v32.78,27.9 32.78,29.17 35.32,31.71 35.32,32.34 U$2.A2 | IR-SENSOR.3 13.45,48.89 13.48,48.87
  Bottom 0.305: GYRO.SCL 37.03,22.88 32.78,27.14 v32.78,27.9
  Bottom 0.61: v16.27,47.2 27.45,47.2 29.73,44.92 29.73,40.34 35.32,34.76 35.32,32.64 U$2.A2
N$56  (via drill 0.64 pad 1.02)
  Top 0.406: 63.98,17.39 63.85,17.03 U$1.IR-AN | v62.6,19.76 62.1,20.26 62.1,23.89 C15.+
  Top 0.813: U$6.5 61.28,10.16 v61.59,9.85 | v62.6,19.76 64.19,19.76 | 64.19,19.76 C13.2 | 64.19,19.76 64.19,17.56 63.98,17.39
  Bottom 0.813: v61.59,9.85 61.33,10.1 61.33,18.49 v62.6,19.76
N$57
  Top 0.305: U$1.VDD 63.71,13.85 66.26,11.3 66.26,10.63 R21.2 | C14.2 68.06,11.22 67.45,10.61 R21.2 | C16.+ 62.21,7.67 63.01,8.48 65.4,8.48 66.26,9.34 66.26,10.59 R21.2
N$58  (via drill 0.64 pad 1.02)
  Top 0.305: R2.1 35.45,30.06 34.81,29.42 v34.81,28.41
  Top 0.61: SCHLAGSENSOR.3 2.98,47.52 3.25,47.52 5.03,49.3 5.03,52.6 6.06,53.63 10.94,53.63 | 10.94,53.63 12.77,53.63 12.84,53.55 16.14,53.55 | R2.1 37.29,31.77 U$2.A3 37.86,32.64 37.86,33.49 36.59,34.76 29.48,34.76 26.69,37.55 24.65,37.55 23.38,38.82 23.38,51.77 21.61,53.55 16.14,53.55 | 15.99,53.4 16.14,53.55 | IR-SENSOR.2 10.91,53.6 10.94,53.63
  Bottom 0.305: v34.81,28.41 34.81,27.29 38.57,23.53 GYRO.SDA
N$61
  Top 0.305: U$6.3 62.2,14.83 62.3,14.93 63.68,14.93 U$1.SCL
N$67  (1 unrouted)
  Top 0.61: 48.33,32.64 48.33,34.3 49.55,35.52 49.55,44.92 50.82,46.19 50.82,48.23 POTI3.VALUE
N$69
  Top 0.61: B3.4 33.28,12.14 37.86,16.72 37.86,17.1 U$2.D5 38.01,19.92 R9.1
(copper drawn outside any net)
  shapes: Top area x2